# EAGLE design OSD Shield (EAGLE 6.2)
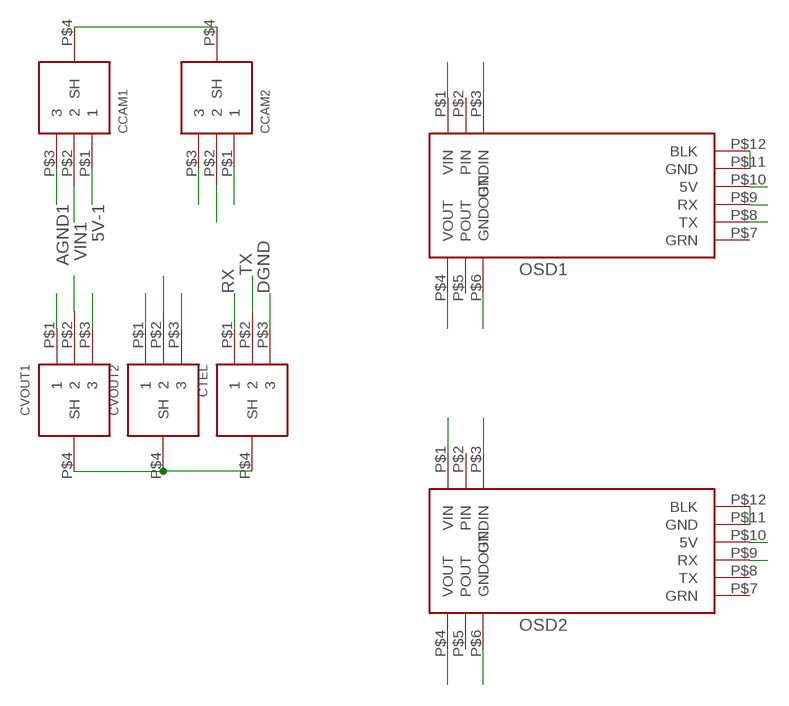
[diagram p0: schematic, sheet 1]

## Parts
CCAM1  TRA3M  [TRA3M]
CCAM2  TRA3M  [TRA3M]
CTEL  TRA3MBARE  [TRA3M-BARE]
CVOUT1  TRA3MBARE  [TRA3M-BARE]
CVOUT2  TRA3MBARE  [TRA3M-BARE]
OSD1  MINIM-OSD  [MINIM-OSD]
OSD2  MINIM-OSD  [MINIM-OSD]

## Nets
5V-1: CCAM1.P$1 CVOUT1.P$1 OSD1.P$10(5V)
5V-2: CCAM2.P$1 CVOUT2.P$1 OSD2.P$10(5V)
AGND1: CCAM1.P$3 CVOUT1.P$3 OSD1.P$3(GNDIN) OSD1.P$6(GNDOUT)
AGND2: CCAM2.P$3 CVOUT2.P$3 OSD2.P$3(GNDIN) OSD2.P$6(GNDOUT)
DGND: CTEL.P$3 OSD1.P$11(GND) OSD1.P$12(BLK) OSD2.P$11(GND) OSD2.P$12(BLK)
RX: CTEL.P$1 OSD1.P$9(RX) OSD2.P$9(RX)
SHLD: CCAM1.P$4(SH) CCAM2.P$4(SH) CTEL.P$4(SH) CVOUT1.P$4(SH) CVOUT2.P$4(SH)
TX: CTEL.P$2 OSD1.P$8(TX)
VIN1: CCAM1.P$2 OSD1.P$1(VIN)
VIN2: CCAM2.P$2 OSD2.P$1(VIN)
VOUT1: CVOUT1.P$2 OSD1.P$4(VOUT)
VOUT2: CVOUT2.P$2 OSD2.P$4(VOUT)
Unconnected: OSD1.P$2(PIN) OSD1.P$5(POUT) OSD1.P$7(GRN) OSD2.P$2(PIN) OSD2.P$5(POUT) OSD2.P$7(GRN) OSD2.P$8(TX)

## Library data of the parts
CCAM1 CCAM2 CTEL CVOUT1 CVOUT2 = custom-parts:TRA3M
OSD1 OSD2 = custom-parts:MINIM-OSD

## Board
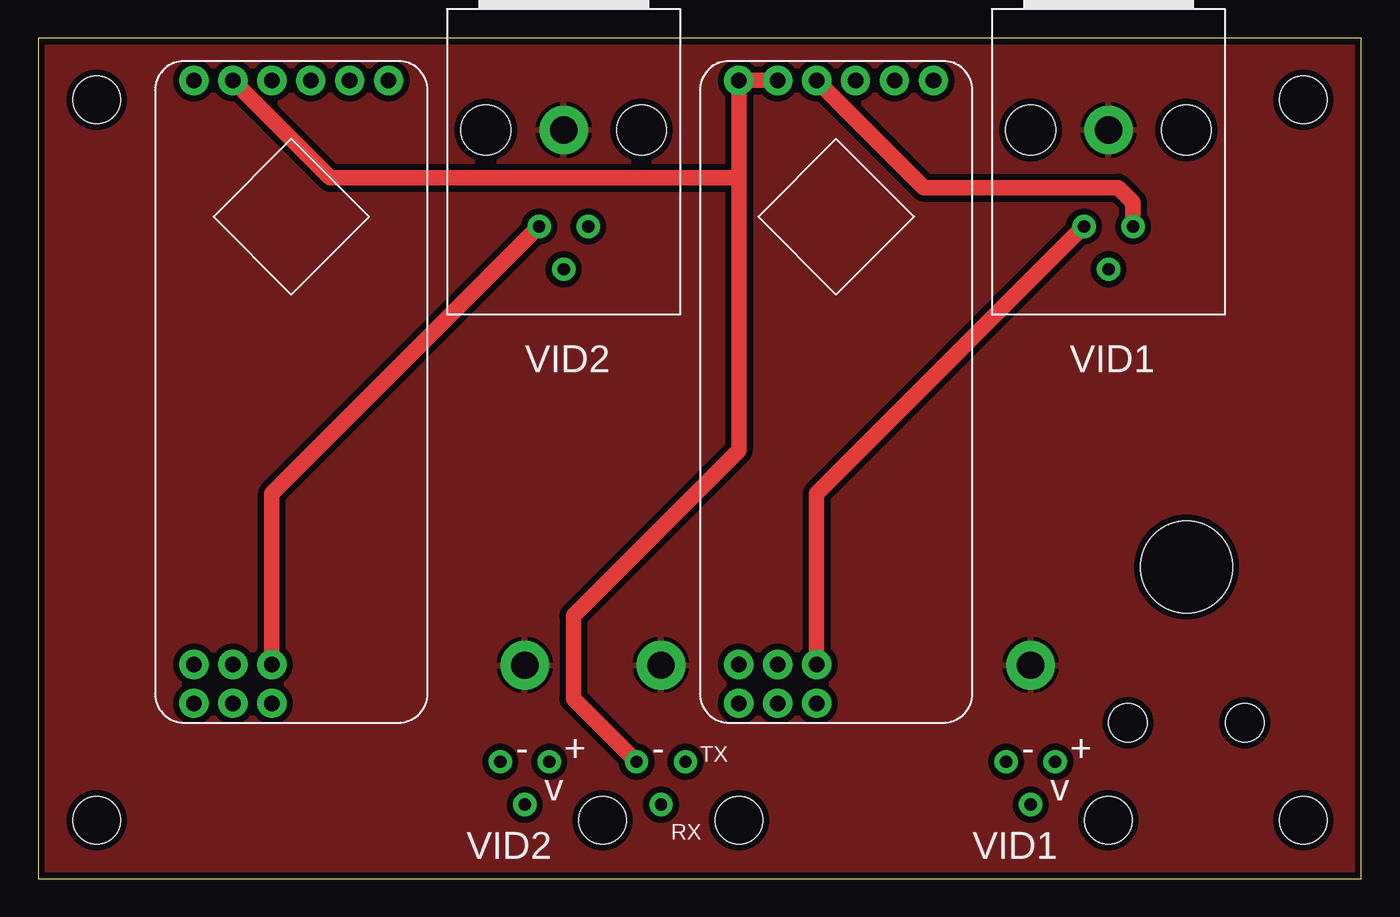
[diagram p1: board, top side]
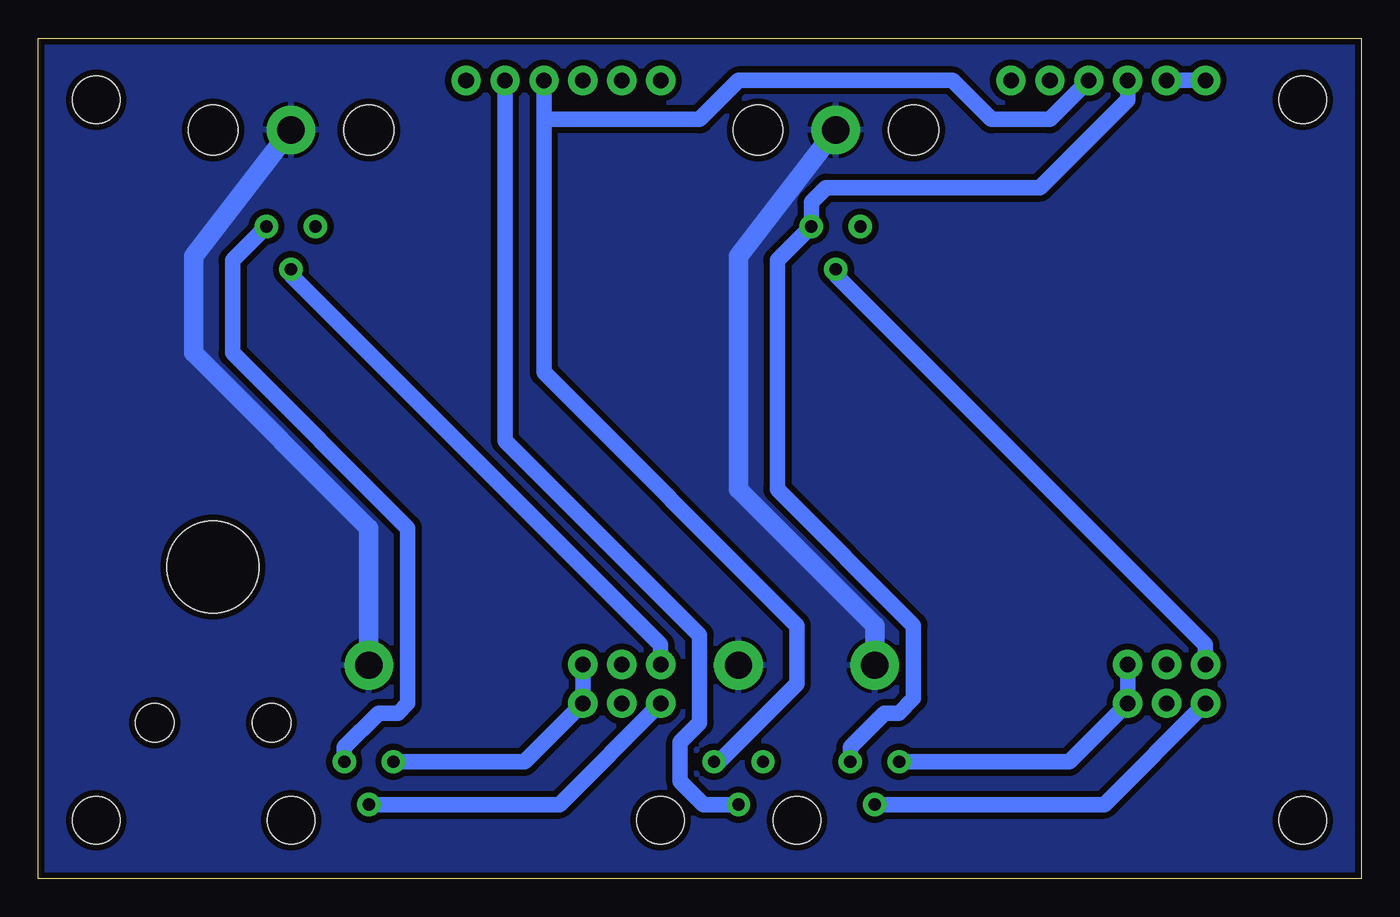
[diagram p2: board, bottom side, seen from below]

Size 86.34 x 54.82 mm. Coordinates in mm from the lower left corner, seen from the top.
Outline: 0,0 86.34,0 86.34,54.82 0,54.82 0,0
Copper layers (1*16): Top 0.0356mm / dielectric 1.5011mm / Bottom 0.0356mm
Design rules: minimum track width 6mil, minimum drill 13mil, track to track 6mil, track to pad 6mil, pad to pad 6mil, via to via 6mil, smd to smd 6mil, copper to edge 15mil, drill to drill 6mil, minimum pad ring 7mil, minimum via ring 7mil, stop-mask expansion 4mil, vias tented up to drill 0mil, thermal gap 10mil
Holes 3.1 mm at 3.81,3.81 3.81,50.8 82.55,50.8 82.55,3.81 45.72,3.81 36.83,3.81 69.85,3.81
Holes 6 mm at 74.93,20.32
Holes 2.5 mm at 71.12,10.16 78.74,10.16

### Footprints (pad centres in the part's own frame; a part is rotated, then mirrored left to right if it is on the bottom)
TRA3M = drill 0.8 pad 1.524: P$1 0,-1.6; P$2 -2.794,0; P$3 0,1.6 | drill 1.778 pad 3.175: P$4 6.299,0 | hole 3.251: 6.299,5.08; 6.299,-5.08
TRA3M-BARE = drill 0.8 pad 1.524: P$1 0,-1.6; P$2 -2.794,0; P$3 0,1.6 | drill 1.778 pad 3.175: P$4 6.299,0
MINIM-OSD = drill 1.016 pad 1.905: P$1 39.37,2.54; P$2 39.37,5.08; P$3 39.37,7.62; P$4 41.91,2.54; P$5 41.91,5.08; P$6 41.91,7.62; P$7 1.27,15.24; P$8 1.27,12.7; P$9 1.27,10.16; P$10 1.27,7.62; P$11 1.27,5.08; P$12 1.27,2.54

### Placement (x,y rotation side)
CCAM1  69.85,42.55 90 top
CCAM2  34.29,42.55 90 top
CTEL  40.64,7.62 90 top
CVOUT1  64.77,7.62 90 top
CVOUT2  31.75,7.62 90 top
OSD1  43.18,53.34 270 top
OSD2  7.62,53.34 270 top

### Tracks (layer width: path | path; a pad name or v marks a point on that pad's centre or on a via)
5V-1
  Top 1.016: OSD1.P$10 57.78,45.09 70.48,45.09 71.45,44.12 CCAM1.P$1
  Bottom 0.635: 66.04,7.62 CVOUT1.P$1
  Bottom 1.016: CCAM1.P$1 73.66,40.34 73.66,34.29 62.23,22.86 62.23,11.43 62.87,10.79 64.14,10.79 66.37,8.56 CVOUT1.P$1
5V-2
  Bottom 1.016: OSD2.P$10 15.24,50.8 20.95,45.09 34.92,45.09 35.89,44.12 CCAM2.P$1 38.1,40.34 38.1,25.4 29.21,16.51 29.21,11.76 30.18,10.79 31.11,10.79 33.35,8.56 CVOUT2.P$1
AGND1
  Top 1.016: CCAM1.P$3 50.8,25.09 OSD1.P$3
  Bottom 1.016: OSD1.P$3 OSD1.P$6 54.61,7.62 CVOUT1.P$3
AGND2
  Top 1.016: OSD2.P$3 15.24,25.09 CCAM2.P$3
  Bottom 1.016: CVOUT2.P$3 19.05,7.62 OSD2.P$6 OSD2.P$3
DGND
  Top 1.016: OSD2.P$11 19.05,45.72 45.72,45.72 | OSD1.P$11 OSD1.P$12 45.72,45.72 | 45.72,45.72 45.72,27.94 34.92,17.14 34.92,11.73 CTEL.P$3
  Bottom 1.016: OSD2.P$12 OSD2.P$11
RX
  Bottom 1.016: 53.34,49.53 53.34,33.02 36.83,16.51 36.83,12.7 41.91,7.62 CTEL.P$1 | 53.34,49.53 OSD1.P$9 | OSD2.P$9 20.32,49.53 24.13,49.53 26.67,52.07 40.64,52.07 43.18,49.53 53.34,49.53
SHLD
  Bottom 1.27: CVOUT2.P$4 31.75,16.51 40.64,25.4 40.64,40.59 CCAM2.P$4 | CVOUT1.P$4 64.77,22.86 76.2,34.29 76.2,40.59 CCAM1.P$4
  pour Bottom (isolate 0.406): 0,54.61 86.36,54.61 86.36,0 0,0
  pour Top (isolate 0.406): 0,0 86.36,0 86.36,54.61 0,54.61
TX
  Bottom 1.016: CTEL.P$2 42.93,4.83 44.45,6.35 44.45,8.89 43.18,10.16 43.18,15.88 55.88,28.57 OSD1.P$8
VIN1
  Bottom 1.016: OSD1.P$1 45.72,15.24 69.85,39.37 CCAM1.P$2
VIN2
  Bottom 1.016: OSD2.P$1 10.16,15.24 34.29,39.37 CCAM2.P$2
VOUT1
  Bottom 1.016: CVOUT1.P$2 52.32,4.83 OSD1.P$4
VOUT2
  Bottom 1.016: CVOUT2.P$2 16.76,4.83 OSD2.P$4

### Text on the board
tNames: VID2 | VID1 | - | + | - | TX | - | + | v | v | RX | VID2 | VID1